# Altium schematic sheet PROC051D_QSPI_Flash_Reference.SchDoc: QSPI flash section
size 431 x 279 mm; Date: Not shown in title block; ApprovedBy: Not shown in title block; CheckedBy: Not shown in title block; Author: Not shown in title block; CompanyName: Not shown in title block; Engineer: Not shown in title block; Organization: Not shown in title block; Address1: Not shown in title block; Address2: Not shown in title block; Address3: Not shown in title block; Address4: Not shown in title block; DocumentNumber: 6; Revision: Use project parameter SCH_Rev; SheetNumber: 6; SheetTotal: 16; PageSetup: Record=PageOptions|CenterHorizontal=True|CenterVertical=True|PrintScale=1.00|XCorrection=1.00|YCorrection=1.00|PrintKind=0|BorderSize=5000000|LeftOffset=0|BottomOffset=0|Orientation=2|PaperLength=1000|PaperWidth=1000|Scale=100|PaperSource=15|PrintQuality=600|MediaType=1|DitherType=10|PaperKind=Letter|PrintScaleMode=1; CurrentTime: Not shown in title block; CurrentDate: Not shown in title block; Time: Not shown in title block; DocumentFullPathAndName: Not shown in title block; DocumentName: Not shown in title block; ModifiedDate: Not shown in title block; ImagePath: Not shown in title block
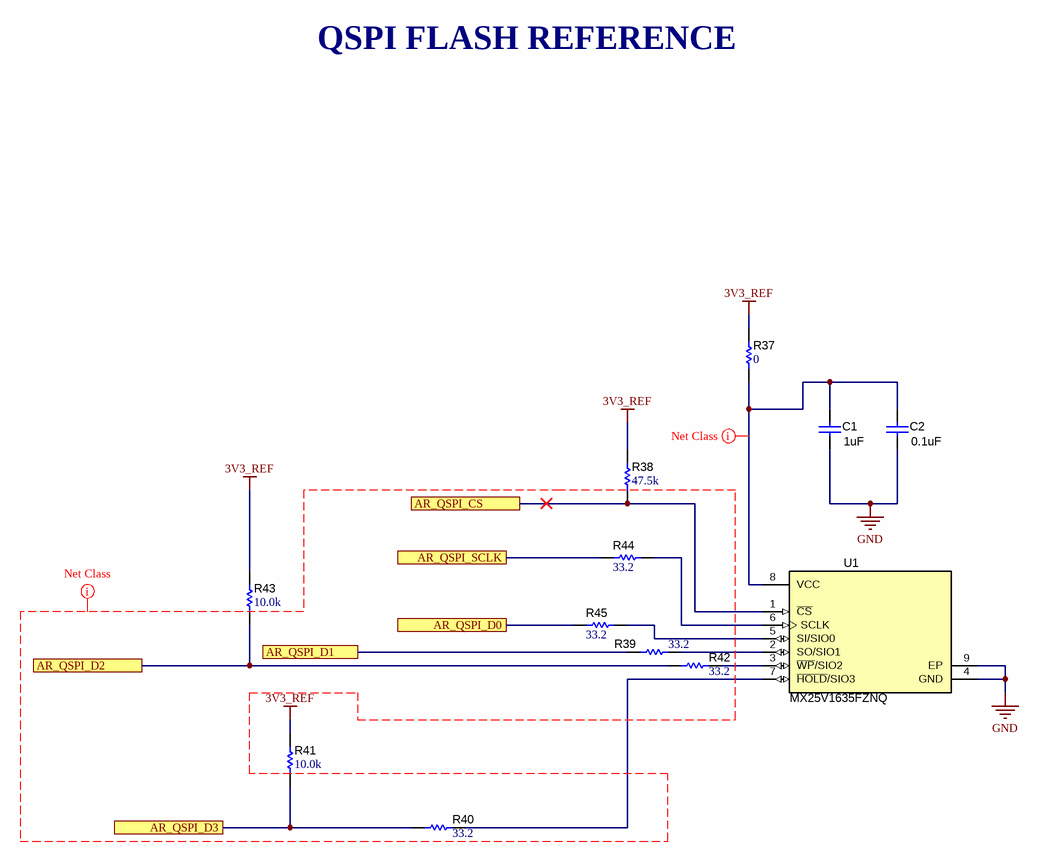
[diagram p0: PROC051D_QSPI_Flash_Reference.SchDoc]

## Parts
C1  ValueDisplayed: 1uF  [0603]  (hidden comment: GCM188R71C105KA64D)
C2  ValueDisplayed: 0.1uF  [0402L]  (hidden comment: CGA2B3X7R1H104K050BB)
R37  ValueDisplayed: 0  [0402L]  (hidden comment: ERJ-2GE0R00X)
R38  ValueDisplayed: 47.5k  [0402L]  (hidden comment: CRCW040247K5FKED)
R39  ValueDisplayed: 33.2  [0201_Silk]  (hidden comment: CRCW020133R2FNED)
R40  ValueDisplayed: 33.2  [0201_Silk]  (hidden comment: CRCW020133R2FNED)
R41  ValueDisplayed: 10.0k  [0402L]  (hidden comment: CRCW040210K0FKED)
R42  ValueDisplayed: 33.2  [0201_Silk]  (hidden comment: CRCW020133R2FNED)
R43  ValueDisplayed: 10.0k  [0402L]  (hidden comment: CRCW040210K0FKED)
R44  ValueDisplayed: 33.2  [0201_Silk]  (hidden comment: CRCW020133R2FNED)
R45  ValueDisplayed: 33.2  [0201_Silk]  (hidden comment: CRCW020133R2FNED)
U1  MX25V1635FZNQ  [WSON-8L_6x5MM_EP]

## Ports
AR_QSPI_CS, AR_QSPI_D0, AR_QSPI_D1, AR_QSPI_D2, AR_QSPI_D3, AR_QSPI_SCLK

## Nets
3V3_REF: R37.1 R38.2 R41.2 R43.2
GND: C1.1 C2.1 U1.4(GND) U1.9(EP)
AR_QSPI_CS: R38.1 U1.1(~{CS}) ; port AR_QSPI_CS
AR_QSPI_D0: R45.2 ; port AR_QSPI_D0
AR_QSPI_D1: R39.1 ; port AR_QSPI_D1
AR_QSPI_D2: R42.1 R43.1 ; port AR_QSPI_D2
AR_QSPI_D3: R40.2 R41.1 ; port AR_QSPI_D3
AR_QSPI_SCLK: R44.2 ; port AR_QSPI_SCLK
NetC1_2: C1.2 C2.2 R37.2 U1.8(VCC)
NetR39_2: R39.2 U1.2(SO/SIO1)
NetR40_1: R40.1 U1.7(~{HOLD}/SIO3)
NetR42_2: R42.2 U1.3(~{WP}/SIO2)
NetR44_1: R44.1 U1.6(SCLK)
NetR45_1: R45.1 U1.5(SI/SIO0)

## Layout directives
net class PWR: NetC1_2
net class QSPI: 3V3_REF

## Notes on the sheet
- QSPI FLASH REFERENCE
- Drawn By:
- SVN Rev:
- Number:
- TID #:
- Orderable:
- Rev:
- Sheet Title:
- File:
- Project Title:
- Designed for:
- Assembly Variant:
- Mod. Date:
- Sheet:
- Size:
- of
- B
- http://www.ti.com
- Texas Instruments and/or its licensors do not warrant the accuracy or completeness of this specification or any information contained therein. Texas Instruments and/or its licensors do not warrant that this design will meet the specifications, will be suitable for your application or fit for any particular purpose, or will operate in an implementation. Texas Instruments and/or its licensors do not warrant that the design is production worthy. You should completely validate and test your design implementation to confirm the system functionality for your application.
- Engineer:
- Contact:
- © Texas Instruments

## Library data of the parts
C1 = CMP-0007136-5: CAP, CERM, 1 uF, 16 V, +/- 10%, X7R, AEC-Q200 Grade 1, 0603; Manufacturer: MuRata; TaMin_C: -55°C; Polarized: N; SizeAreaWB_mm2: 4.68; Value1: Unknown; U/M: EA; Value: 1uF; TaMax_C: 125°C; SizeZ_mm: 1; SizeX_mm: 1.6; SizeY_mm: 0.8; Value2: 16V; SizeArea_mm2: 1.28; AEC Qualified: Y; Cap_F: 1µF; AEC Category: Q200; Supplier Part Number 2: 81-GCM188R71C105K64D; Publisher: Texas Instruments; Supplier 2: Mouser; TempCo: X7R; Published: 2008-06-19; RoHS: Y; MountType: SMT; Supplier 1: Digi-Key; PackageReference: 0603; Tolerance_%: 10%; Cap_Case: 0603; CompType: Capacitor; LatestRevisionDate: 2017-03-09; PartNumber: GCM188R71C105KA64D; VDC_V: 16V; ComponentLink1Description: Datasheet link; AEC Grade: 1; Supplier Part Number 1: 490-5241-6-ND; Technology: Ceramic; ComponentLink1URL: http://psearch.en.murata.com/capacitor/product/GCM188R71C105KA64%23.pdf
C2 = CMP-0006325-2: CAP, CERM, 0.1 uF, 50 V, +/- 10%, X7R, AEC-Q200 Grade 1, 0402; Manufacturer: TDK; TaMin_C: -55°C; ESR_ohm: 0.039064; Polarized: N; SizeAreaWB_mm2: 3; Value1: 0.039064 ohm; U/M: EA; Value: 0.1uF; TaMax_C: 125°C; SizeZ_mm: 0.6; SizeX_mm: 1; SizeY_mm: 0.5; Cap_Case: 0402; Value2: 50V; AEC Qualified: Y; Cap_F: 100nF; IRMS_A: 8.14669dA; AEC Category: Q200; Supplier Part Number 2: 04X3148; Publisher: Texas Instruments; Supplier 2: Newark; Supplier Part Number 3: 810-CGA2B3X7R1H104K; TempCo: X7R; Supplier 3: Mouser; Published: 2008-06-19; RoHS: Y; MountType: SMT; Supplier 1: Digi-Key; PackageReference: 0402; Tolerance_%: 10%; SizeArea_mm2: 0.5; CompType: Capacitor; LatestRevisionDate: 2017-03-09; PartNumber: CGA2B3X7R1H104K050BB; VDC_V: 50V; ComponentLink1Description: Datasheet link; AEC Grade: 1; Supplier Part Number 1: 445-6899-1-ND; Technology: Ceramic; ComponentLink1URL: https://product.tdk.com/en/search/capacitor/ceramic/mlcc/info?part_no=CGA2B3X7R1H104K050BB
R37 = CMP-0026992-3: RES, 0, 5%, 0.1 W, AEC-Q200 Grade 0, 0402; Manufacturer: Panasonic; Power_W: 100mW; TempCo: 600 ppm/C; Value_Code: 0000; Value: 0; EIA_Code: E24; SizeX_mm: 1; SizeY_mm: 0.5; SizeZ_mm: 0.6; Value2: 0.1W; AEC Qualified: Y; VDC_V: 50V; AEC Category: Q200; SizeAreaWB_mm2: 3; Supplier Part Number 2: 65T8307; Supplier 2: Newark; Supplier Part Number 3: 667-ERJ-2GE0R00X; Supplier 3: Mouser; RoHS: Y; Value1: 5%; MountType: SMT; Supplier 1: Digi-Key; PackageReference: 0402; Tolerance_%: 5%; Res_ohm: 0; SizeArea_mm2: 0.5; CompType: Resistor; PartNumber: ERJ-2GE0R00X; ComponentLink1Description: Datasheet link; Supplier Part Number 1: P0.0JCT-ND; Technology: Thick Film; ComponentLink1URL: https://industrial.panasonic.com/cdbs/www-data/pdf/RDA0000/AOA0000C301.pdf; AEC Grade: 0
R38 = CMP-0026395-2: RES, 47.5 k, 1%, 0.063 W, AEC-Q200 Grade 0, 0402; Manufacturer: Vishay-Dale; Power_W: 63mW; TempCo: 100 ppm/C; Value_Code: 47k5; Value: 47.5k; EIA_Code: E96; SizeX_mm: 1; SizeY_mm: 0.5; SizeZ_mm: 0.6; Value2: 0.063W; AEC Qualified: Y; VDC_V: 50V; AEC Category: Q200; AEC Grade: 0; ComponentLink1URL: http://www.vishay.com/docs/20035/dcrcwe3.pdf; Supplier Part Number 2: 52K7100; Supplier 2: Newark; Supplier Part Number 3: 71-CRCW0402-47.5K-E3; Supplier 3: Mouser; RoHS: E; Value1: 1%; MountType: SMT; Supplier 1: Digi-Key; PackageReference: 0402; Tolerance_%: 1%; Res_ohm: 47.5k; SizeArea_mm2: 0.5; CompType: Resistor; PartNumber: CRCW040247K5FKED; ComponentLink1Description: Datasheet link; Supplier Part Number 1: 541-47.5KLCT-ND; Technology: Thick Film
R39 R40 R42 R45 = CMP-0027275-3: RES, 33.2, 1%, 0.05 W, 0201; Manufacturer: Vishay-Dale; Power_W: 50mW; TempCo: 200 ppm/C; Value_Code: 33R2; Value: 33.2; EIA_Code: E96; SizeX_mm: 0.6; SizeY_mm: 0.3; SizeZ_mm: 0.26; Value2: 0.05W; SizeArea_mm2: 0.18; AEC Qualified: N; AEC Category: Q200; Supplier Part Number 2: 26W8649; Supplier 2: Newark; Supplier Part Number 3: 71-CRCW020133R2FNED; Supplier 3: Mouser; RoHS: E; Value1: 1%; MountType: SMT; Supplier 1: Digi-Key; PackageReference: 0201; Tolerance_%: 1%; Res_ohm: 33.2; CompType: Resistor; PartNumber: CRCW020133R2FNED; ComponentLink1Description: Datasheet link; AEC Grade: N/A; Supplier Part Number 1: 541-33.2ABCT-ND; Technology: Thick Film; ComponentLink1URL: http://www.vishay.com/docs/20052/crcw0201e3.pdf
R41 R43 = CMP-0025958-3: RES, 10.0 k, 1%, 0.063 W, AEC-Q200 Grade 0, 0402; Manufacturer: Vishay-Dale; Power_W: 63mW; TempCo: 100 ppm/C; Value_Code: 10k0; Value: 10.0k; EIA_Code: E96; Res_ohm: 10k; SizeX_mm: 1; SizeY_mm: 0.5; SizeZ_mm: 0.6; Value2: 0.063W; AEC Qualified: Y; VDC_V: 50V; AEC Category: Q200; AEC Grade: 0; Supplier Part Number 2: 52K6595; Supplier 2: Newark; Supplier Part Number 3: 71-CRCW0402-10K-E3; Supplier 3: Mouser; RoHS: E; Value1: 1%; MountType: SMT; Supplier 1: Digi-Key; PackageReference: 0402; Tolerance_%: 1%; SizeArea_mm2: 0.5; CompType: Resistor; PartNumber: CRCW040210K0FKED; ComponentLink1Description: Datasheet link; Supplier Part Number 1: 541-10.0KLCT-ND; Technology: Thick Film; ComponentLink1URL: http://www.vishay.com/docs/20035/dcrcwe3.pdf
R44 = CMP-0027275-3: RES, 33.2, 1%, 0.05 W, 0201; Manufacturer: Vishay-Dale; Power_W: 50mW; TempCo: 200 ppm/C; Value_Code: 33R2; Value: 33.2; EIA_Code: E96; SizeX_mm: 0.6; SizeY_mm: 0.3; SizeZ_mm: 0.26; Value2: 0.05W; SizeArea_mm2: 0.18; CompType: Resistor; AEC Qualified: N; AEC Category: Q200; Supplier Part Number 2: 26W8649; Supplier 2: Newark; Supplier Part Number 3: 71-CRCW020133R2FNED; Supplier 3: Mouser; RoHS: E; Value1: 1%; MountType: SMT; Supplier 1: Digi-Key; PackageReference: 0201; Tolerance_%: 1%; Res_ohm: 33.2; PartNumber: CRCW020133R2FNED; ComponentLink1Description: Datasheet link; AEC Grade: N/A; Supplier Part Number 1: 541-33.2ABCT-ND; Technology: Thick Film; ComponentLink1URL: http://www.vishay.com/docs/20052/crcw0201e3.pdf
U1 = CMP-0079267-1: 2.3V-3.6V, 16M-BIT [x 1/x 2/x 4] CMOS FLASH Memory, WSON-8; Manufacturer: Macronix International Co., LTD; SizeArea_mm2: 30; SizeAreaWB_mm2: 56; SizeY_mm: 5; SizeZ_mm: 0.8; SizeX_mm: 6; PartNumber: MX25V1635FZNQ; PackageReference: WSON-8; Supplier Part Number 1: 1092-1211-ND; ComponentLink1Description: Datasheet URL; MountType: SMT; ComponentLink1URL: http://www.macronix.com/Lists/Datasheet/Attachments/6724/MX25V1635F,%202.5V,%2016Mb,%20v1.4.pdf; Supplier 1: Digi-Key; RoHS: Y